# EAGLE schematic 411V2 (EAGLE 9.1.3)

## Sheet 1 of 2
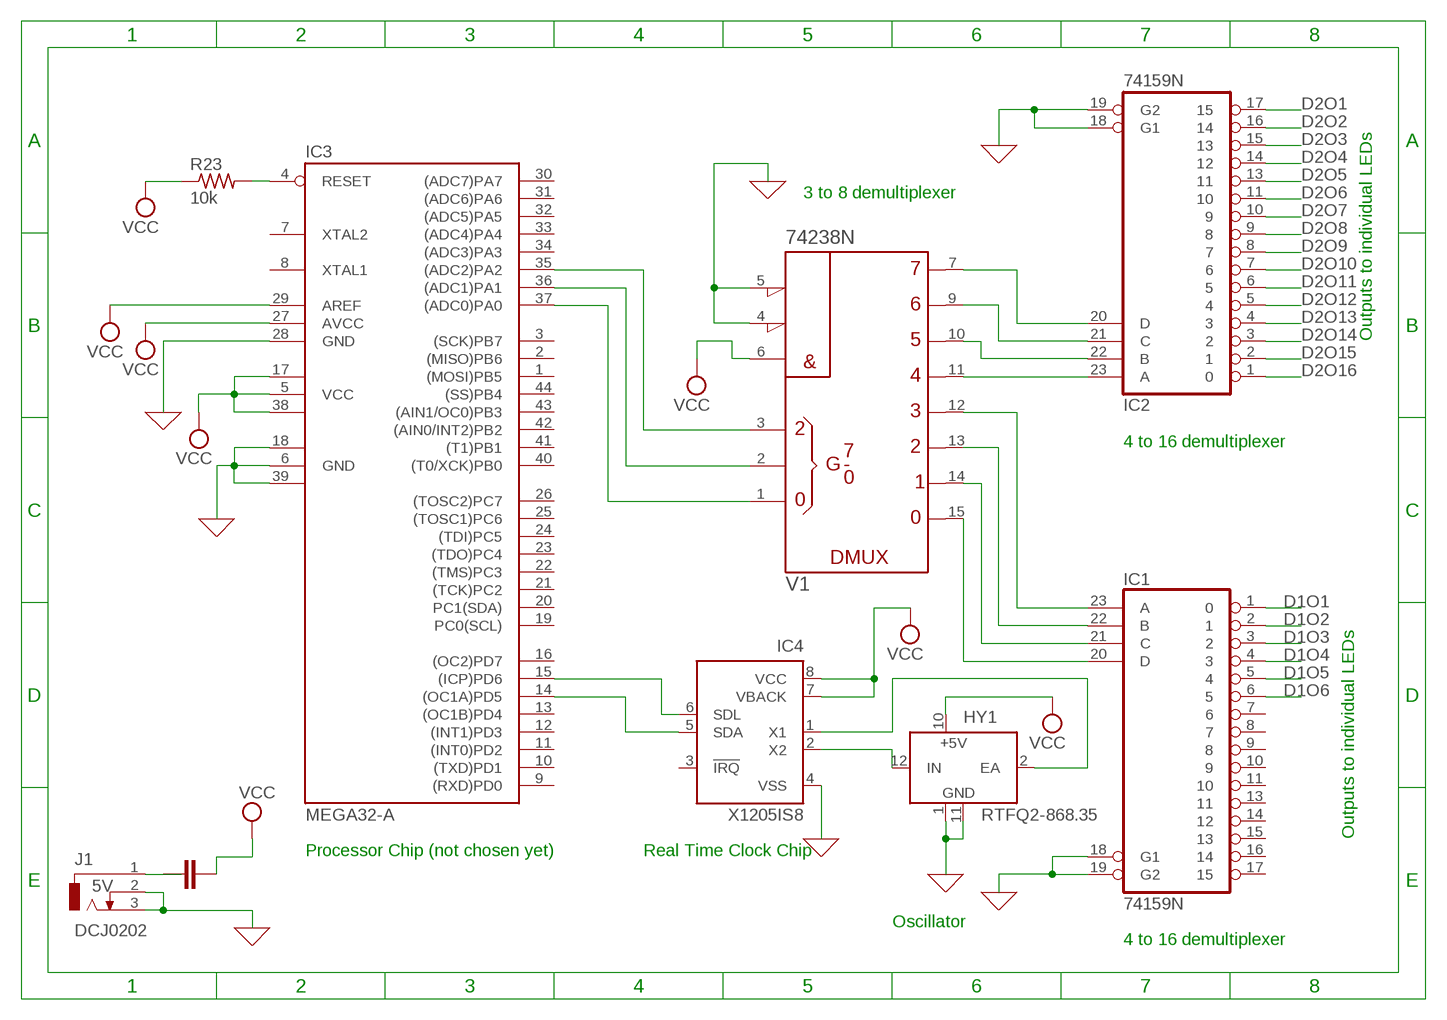
[diagram p0: schematic, sheet 1]

### Parts
HY1  RTFQ2-868.35  [RTFQ2]
IC1  74159N  [DIL24-6]
IC2  74159N  [DIL24-6]
IC3  MEGA32-A  [TQFP44]
IC4  X1205IS8  [SO-08]
J1  DCJ0202  [DCJ0202]
R23  10k  R-US_0204/2V  [0204V]
V1  74238N  [DIL16]

### Nets
0: HY1.1(GND) HY1.11(GND) IC1.18(G1) IC1.19(G2) IC2.18(G1) IC2.19(G2) IC3.6(GND) IC3.18(GND1) IC3.28(GND) IC3.39(GND2) IC4.4(VSS) J1.2 J1.3 V1.4(!G2A) V1.5(!G2B) ; supply symbol labelled GND ; also sheet 2
D1O1: IC1.1 ; also sheet 2
D1O2: IC1.2 ; also sheet 2
D1O3: IC1.3 ; also sheet 2
D1O4: IC1.4 ; also sheet 2
D1O5: IC1.5 ; also sheet 2
D1O6: IC1.6 ; also sheet 2
D2O1: IC2.17 ; also sheet 2
D2O2: IC2.16 ; also sheet 2
D2O3: IC2.15 ; also sheet 2
D2O4: IC2.14 ; also sheet 2
D2O5: IC2.13 ; also sheet 2
D2O6: IC2.11 ; also sheet 2
D2O7: IC2.10 ; also sheet 2
D2O8: IC2.9 ; also sheet 2
D2O9: IC2.8 ; also sheet 2
D2O10: IC2.7 ; also sheet 2
D2O11: IC2.6 ; also sheet 2
D2O12: IC2.5 ; also sheet 2
D2O13: IC2.4 ; also sheet 2
D2O14: IC2.3 ; also sheet 2
D2O15: IC2.2 ; also sheet 2
D2O16: IC2.1 ; also sheet 2
N$1: IC1.20(D) V1.15(Y0)
N$2: IC1.21(C) V1.14(Y1)
N$3: IC1.22(B) V1.13(Y2)
N$4: IC1.23(A) V1.12(Y3)
N$5: IC2.23(A) V1.11(Y4)
N$6: IC2.22(B) V1.10(Y5)
N$7: IC2.21(C) V1.9(Y6)
N$8: IC2.20(D) V1.7(Y7)
N$9: IC3.37((ADC0)PA0) V1.1(A)
N$13: IC3.36((ADC1)PA1) V1.2(B)
N$16: IC3.35((ADC2)PA2) V1.3(C)
N$18: IC3.4(RESET) R23.2
N$22: HY1.2(EA) IC4.1(X1)
N$33: J1.1
N$37: HY1.12(IN) IC4.2(X2)
N$38: IC3.14((OC1A)PD5) IC4.5(SDA)
N$40: IC3.15((ICP)PD6) IC4.6(SDL)
VCC: HY1.10(+5V) IC3.5(VCC) IC3.17(VCC1) IC3.27(AVCC) IC3.29(AREF) IC3.38(VCC2) IC4.7(VBACK) IC4.8(VCC) R23.1 V1.6(G1)
Unconnected: IC1.7 IC1.8 IC1.9 IC1.10 IC1.11 IC1.13 IC1.14 IC1.15 IC1.16 IC1.17 IC3.1((MOSI)PB5) IC3.2((MISO)PB6) IC3.3((SCK)PB7) IC3.7(XTAL2) IC3.8(XTAL1) IC3.9((RXD)PD0) IC3.10((TXD)PD1) IC3.11((INT0)PD2) IC3.12((INT1)PD3) IC3.13((OC1B)PD4) IC3.16((OC2)PD7) IC3.19(PC0(SCL)) IC3.20(PC1(SDA)) IC3.21((TCK)PC2) IC3.22((TMS)PC3) IC3.23((TDO)PC4) IC3.24((TDI)PC5) IC3.25((TOSC1)PC6) IC3.26((TOSC2)PC7) IC3.30((ADC7)PA7) IC3.31((ADC6)PA6) IC3.32((ADC5)PA5) IC3.33((ADC4)PA4) IC3.34((ADC3)PA3) IC3.40((T0/XCK)PB0) IC3.41((T1)PB1) IC3.42((AIN0/INT2)PB2) IC3.43((AIN1/OC0)PB3) IC3.44((SS)PB4) IC4.3(!IRQ)

### Notes on the sheet
- 3 to 8 demultiplexer
- Outputs to individual LEDs
- 4 to 16 demultiplexer
- Outputs to individual LEDs
- Processor Chip (not chosen yet) | Real Time Clock Chip
- Oscillator
- 4 to 16 demultiplexer

## Sheet 2 of 2
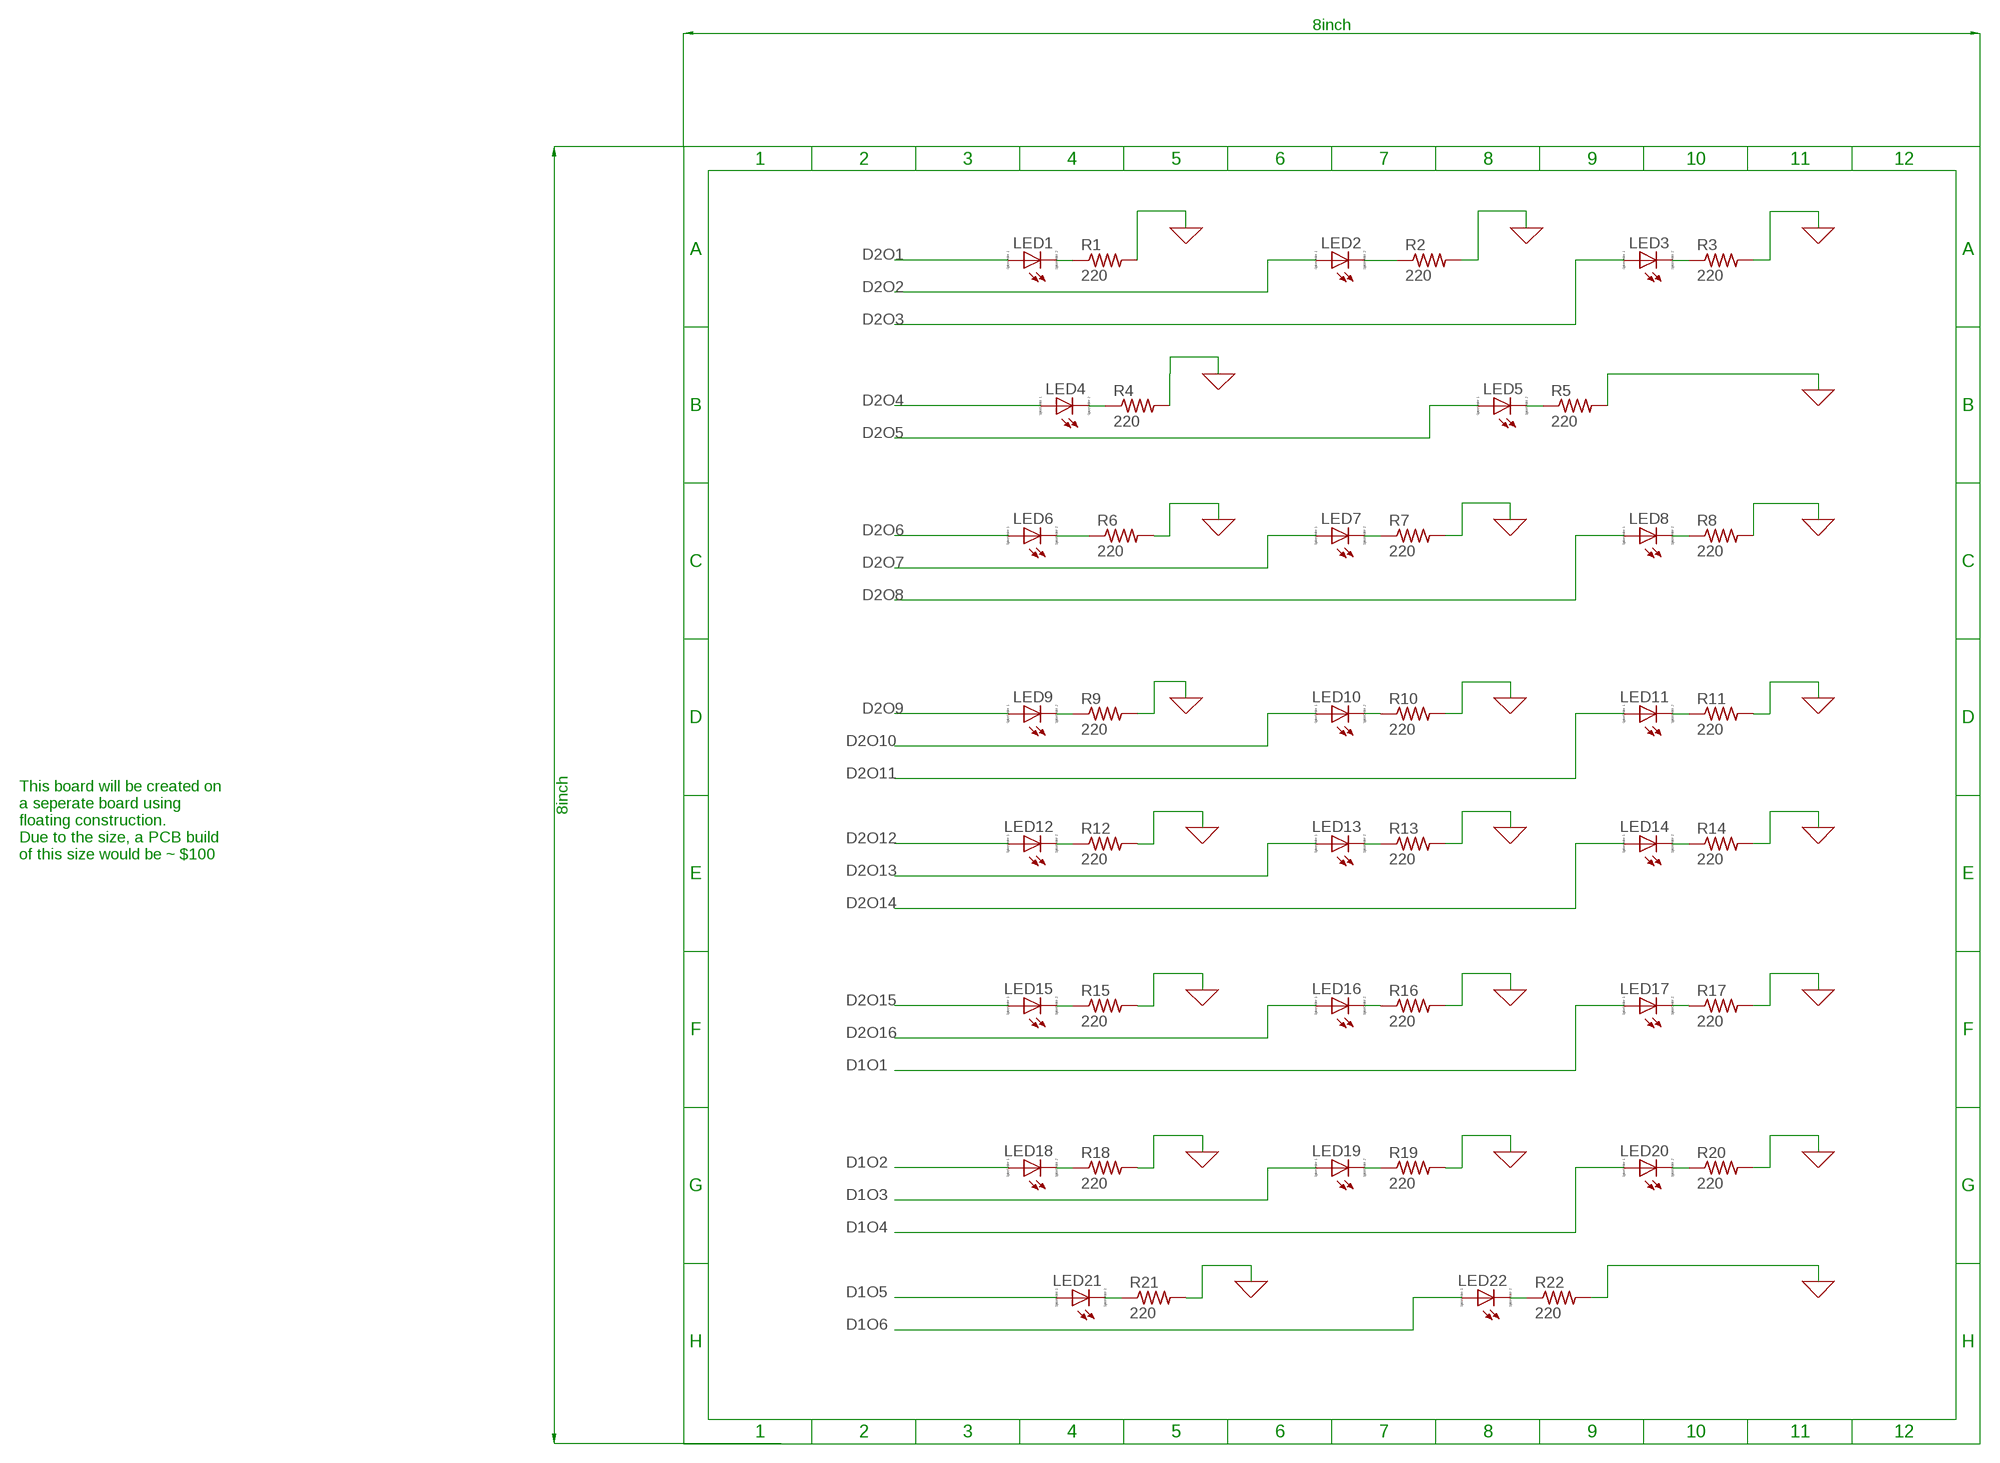
[diagram p1: schematic, sheet 2]

### Parts
LED1  LED_ELD260  [LED_LD260]
LED2  LED_ELD260  [LED_LD260]
LED3  LED_ELD260  [LED_LD260]
LED4  LED_ELD260  [LED_LD260]
LED5  LED_ELD260  [LED_LD260]
LED6  LED_ELD260  [LED_LD260]
LED7  LED_ELD260  [LED_LD260]
LED8  LED_ELD260  [LED_LD260]
LED9  LED_ELD260  [LED_LD260]
LED10  LED_ELD260  [LED_LD260]
LED11  LED_ELD260  [LED_LD260]
LED12  LED_ELD260  [LED_LD260]
LED13  LED_ELD260  [LED_LD260]
LED14  LED_ELD260  [LED_LD260]
LED15  LED_ELD260  [LED_LD260]
LED16  LED_ELD260  [LED_LD260]
LED17  LED_ELD260  [LED_LD260]
LED18  LED_ELD260  [LED_LD260]
LED19  LED_ELD260  [LED_LD260]
LED20  LED_ELD260  [LED_LD260]
LED21  LED_ELD260  [LED_LD260]
LED22  LED_ELD260  [LED_LD260]
R1  220  R-US_0204/5  [0204/5]
R2  220  R-US_0204/5  [0204/5]
R3  220  R-US_0204/5  [0204/5]
R4  220  R-US_0204/5  [0204/5]
R5  220  R-US_0204/5  [0204/5]
R6  220  R-US_0204/5  [0204/5]
R7  220  R-US_0204/5  [0204/5]
R8  220  R-US_0204/5  [0204/5]
R9  220  R-US_0204/5  [0204/5]
R10  220  R-US_0204/5  [0204/5]
R11  220  R-US_0204/5  [0204/5]
R12  220  R-US_0204/5  [0204/5]
R13  220  R-US_0204/5  [0204/5]
R14  220  R-US_0204/5  [0204/5]
R15  220  R-US_0204/5  [0204/5]
R16  220  R-US_0204/5  [0204/5]
R17  220  R-US_0204/5  [0204/5]
R18  220  R-US_0204/5  [0204/5]
R19  220  R-US_0204/5  [0204/5]
R20  220  R-US_0204/5  [0204/5]
R21  220  R-US_0204/5  [0204/5]
R22  220  R-US_0204/5  [0204/5]

### Nets
0: R1.2 R2.2 R3.2 R4.2 R5.2 R6.2 R7.2 R8.2 R9.2 R10.2 R11.2 R12.2 R13.2 R14.2 R15.2 R16.2 R17.2 R18.2 R19.2 R20.2 R21.2 R22.2 ; supply symbol labelled GND ; also sheet 1
D1O1: LED17.A ; also sheet 1
D1O2: LED18.A ; also sheet 1
D1O3: LED19.A ; also sheet 1
D1O4: LED20.A ; also sheet 1
D1O5: LED21.A ; also sheet 1
D1O6: LED22.A ; also sheet 1
D2O1: LED1.A ; also sheet 1
D2O2: LED2.A ; also sheet 1
D2O3: LED3.A ; also sheet 1
D2O4: LED4.A ; also sheet 1
D2O5: LED5.A ; also sheet 1
D2O6: LED6.A ; also sheet 1
D2O7: LED7.A ; also sheet 1
D2O8: LED8.A ; also sheet 1
D2O9: LED9.A ; also sheet 1
D2O10: LED10.A ; also sheet 1
D2O11: LED11.A ; also sheet 1
D2O12: LED12.A ; also sheet 1
D2O13: LED13.A ; also sheet 1
D2O14: LED14.A ; also sheet 1
D2O15: LED15.A ; also sheet 1
D2O16: LED16.A ; also sheet 1
N$10: LED1.K(C) R1.1
N$11: LED2.K(C) R2.1
N$12: LED3.K(C) R3.1
N$14: LED4.K(C) R4.1
N$15: LED5.K(C) R5.1
N$17: LED6.K(C) R6.1
N$19: LED7.K(C) R7.1
N$20: LED8.K(C) R8.1
N$21: LED9.K(C) R9.1
N$23: LED10.K(C) R10.1
N$24: LED12.K(C) R12.1
N$25: LED13.K(C) R13.1
N$26: LED14.K(C) R14.1
N$27: LED17.K(C) R17.1
N$28: LED16.K(C) R16.1
N$29: LED15.K(C) R15.1
N$30: LED11.K(C) R11.1
N$31: LED19.K(C) R19.1
N$32: LED18.K(C) R18.1
N$34: LED20.K(C) R20.1
N$35: LED21.K(C) R21.1
N$36: LED22.K(C) R22.1

### Notes on the sheet
- This board will be created on
  a seperate board using 
  floating construction.
  Due to the size, a PCB build
  of this size would be ~ $100

## Power pins joined to a net without a drawn wire
+UB: V1.16(+UB)
-UB: V1.8(-UB)
GND: IC1.12(GND) IC2.12(GND)
VCC: IC1.24(VCC) IC2.24(VCC)

## Library data of the parts
HY1 = telecontrolli:RTFQ2-*: FSK Radio Transmitter with Crystal Oscillator and External Antenna Source: http://www.telecontrolli.com/eng/default-wproducts.html ... rtfq2.pdf; OC_FARNELL: unknown; OC_NEWARK: unknown
IC1 IC2 = 74xx-us:74*159: 4-line to 16-line DECODER/DEMULTIPLEXER, open collector
IC3 = atmel:MEGA32: MICROCONTROLLER 32 Kbytes FLASH 2 Kbytes SRAM 1 Kbytes EEPROM USART 8-channel 10 bit ADC Source: www.atmel.com .. doc2503.pdf; MPN: ATMEGA32-16AU; OC_FARNELL: 9171274; OC_NEWARK: 69K6677
IC4 = xicor:X1205*: 2-Wire RTC Real Time Clock/Calendar; OC_FARNELL: unknown; OC_NEWARK: unknown
J1 = con-jack:DCJ0202: DC POWER JACK Source: DCJ0202.pdf; OC_FARNELL: 5V; OC_NEWARK: unknown
LED1-LED22 = eagle-ltspice:LED_E: LED Source: http://www.osram.convergy.de Source: www.luxeon.com Source: www.kingbright.com; SPICEMODEL: NONE; SPICEPREFIX: D; SPICETYPE: diode
R1-R22 = rcl:R-US_: RESISTOR, American symbol; SPICEPREFIX: R
R23 = resistor:R-US_: RESISTOR, American symbol
V1 = 74ttl-din:74*238: 1 of 8 noninverting DECODER/DEMULTIPLEXER